# EAGLE design STM32F103C8BRD (EAGLE 7.6.0)
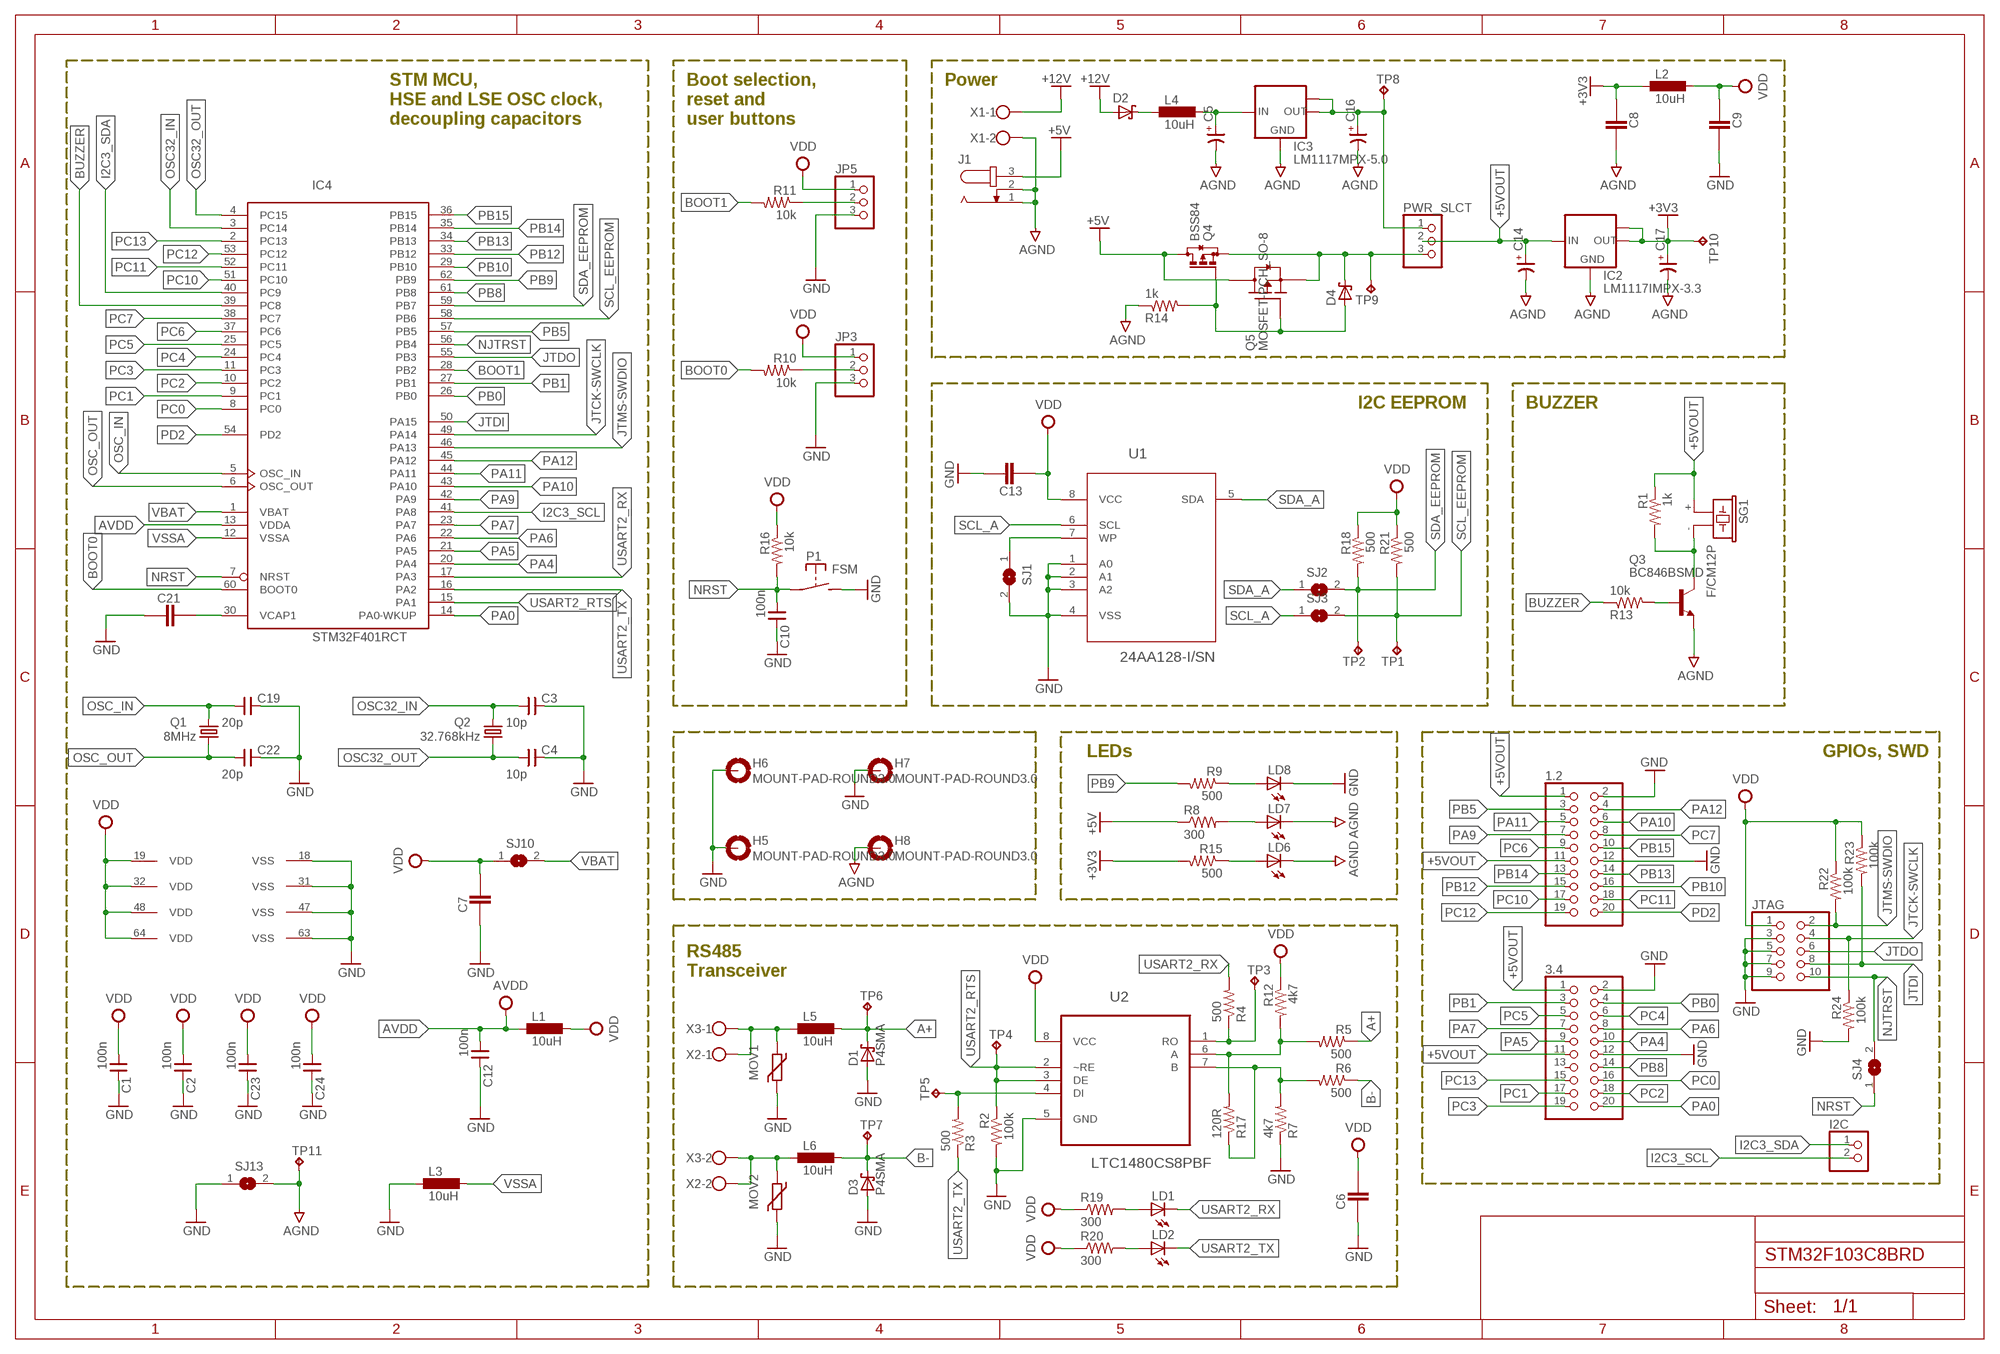
[diagram p0: schematic, sheet 1]

## Parts
1.2  PINHD-2X10  [2X10]
3.4  PINHD-2X10  [2X10]
C1  100n  CNP-0805  [0805]
C2  100n  CNP-0805  [0805]
C3  10p  CNP-0805  [0805]
C4  10p  CNP-0805  [0805]
C5  CP-3258-TE-B  [3528-TE-B]
C6  CAPACITOR_1206  [CAPC3215X168N]
C7  CAPACITOR_1206  [CAPC3215X168N]
C8  CAPACITOR_1206  [CAPC3215X168N]
C9  CAPACITOR_1206  [CAPC3215X168N]
C10  100n  CNP-0805  [0805]
C12  100n  CNP-0805  [0805]
C13  CAPACITOR_1206  [CAPC3215X168N]
C14  CP-3258-TE-B  [3528-TE-B]
C16  CP-3216-TE-A  [3216-TE-A]
C17  CP-3216-TE-A  [3216-TE-A]
C19  20p  CNP-0805  [0805]
C21  CAPACITOR_1206  [CAPC3215X168N]
C22  20p  CNP-0805  [0805]
C23  100n  CNP-0805  [0805]
C24  100n  CNP-0805  [0805]
D1  P4SMA  SCHOTTKY-DIODESMD  [SMB]
D2  SCHOTTKY_SMA  [DIOM5326X292N]
D3  P4SMA  SCHOTTKY-DIODESMD  [SMB]
D4  SCHOTTKY_SMA  [DIOM5326X292N]
H5  MOUNT-PAD-ROUND3.0  [3,0-PAD]
H6  MOUNT-PAD-ROUND3.0  [3,0-PAD]
H7  MOUNT-PAD-ROUND3.0  [3,0-PAD]
H8  MOUNT-PAD-ROUND3.0  [3,0-PAD]
I2C  PINHD-1X2  [1X02]
IC2  LM1117IMPX-3.3  [SOT223]
IC3  LM1117MPX-5.0  [SOT223]
IC4  STM32F401RCT  [LQFP64]
J1  JACK-PLUG1  [SPC4078]
JP3  PINHD-1X3  [1X03]
JP5  PINHD-1X3  [1X03]
JTAG  PINHD-2X5  [2X05]
L1  10uH  INDUCTOR_0603  [INDC1608X95N]
L2  10uH  INDUCTOR_0603  [INDC1608X95N]
L3  10uH  INDUCTOR_0603  [INDC1608X95N]
L4  10uH  INDUCTOR_0603  [INDC1608X95N]
L5  10uH  INDUCTOR_0603  [INDC1608X95N]
L6  10uH  INDUCTOR_0603  [INDC1608X95N]
LD1  LEDCHIPLED_0805  [CHIPLED_0805]
LD2  LEDCHIPLED_0805  [CHIPLED_0805]
LD6  LEDCHIPLED_0805  [CHIPLED_0805]
LD7  LEDCHIPLED_0805  [CHIPLED_0805]
LD8  LEDCHIPLED_0805  [CHIPLED_0805]
MOV1  VARISTOR_0805  [VARC2012X70N]
MOV2  VARISTOR_0805  [VARC2012X70N]
P1  FSM  [FSM]
PWR_SLCT  PINHD-1X3  [1X03]
Q1  8MHz  CRYTALHC49S  [HC49/S]
Q2  32.768kHz  CRYTALTC26H  [TC26H]
Q3  BC846BSMD  [SOT23]
Q4  BSS84  [SOT23]
Q5  MOSFET-PCH_SO-8  [SOIC127P600X175-8AN]
R1  1k  R-US_M0805  [M0805]
R2  100k  R-US_M0805  [M0805]
R3  500  R-US_M0805  [M0805]
R4  500  R-US_M0805  [M0805]
R5  500  R-US_M0805  [M0805]
R6  500  R-US_M0805  [M0805]
R7  4k7  R-US_M0805  [M0805]
R8  300  R-US_M0805  [M0805]
R9  500  R-US_M0805  [M0805]
R10  10k  R-US_M0805  [M0805]
R11  10k  R-US_M0805  [M0805]
R12  4k7  R-US_M0805  [M0805]
R13  10k  R-US_M0805  [M0805]
R14  1k  R-US_M0805  [M0805]
R15  500  R-US_M0805  [M0805]
R16  10k  R-US_M0805  [M0805]
R17  120R  R-US_M0805  [M0805]
R18  500  R-US_M0805  [M0805]
R19  300  R-US_M0805  [M0805]
R20  300  R-US_M0805  [M0805]
R21  500  R-US_M0805  [M0805]
R22  100k  R-US_M0805  [M0805]
R23  100k  R-US_M0805  [M0805]
R24  100k  R-US_M0805  [M0805]
SG1  F/CM12P  [F/CM12P]
SJ1  SJ  [SJ]
SJ2  SJ  [SJ]
SJ3  SJ  [SJ]
SJ4  SJ  [SJ]
SJ10  SJ  [SJ]
SJ13  SJ  [SJ]
TP1  TPTP10R  [TP10R]
TP2  TPTP10R  [TP10R]
TP3  TPTP10R  [TP10R]
TP4  TPTP10R  [TP10R]
TP5  TPTP10R  [TP10R]
TP6  TPTP10R  [TP10R]
TP7  TPTP10R  [TP10R]
TP8  TPTP10R  [TP10R]
TP9  TPTP10R  [TP10R]
TP10  TPTP10R  [TP10R]
TP11  TPTP10R  [TP10R]
U1  24AA128-I/SN  [SOIC127P600X175-8N]
U2  LTC1480CS8PBF  [SOIC127P600X175-8N]
X1  W237-102  [W237-102]
X2  W237-102  [W237-102]
X3  W237-102  [W237-102]

## Nets
+3V3: C8.1 C17.+ IC2.2(OUT) IC2.TAB(OUT1) L2.1 R15.2 TP10.TP
+5V: J1.3 Q4.3(D) Q5.5(D) R8.1
+5VOUT: 1.2.1 1.2.11 3.4.1 3.4.11 C14.+ IC2.3(IN) PWR_SLCT.2 R1.1 SG1.+
+12V: D2.A X1.1
A+: D1.C L5.2 R5.1 TP6.TP
AGND: C5.- C8.2 C14.- C16.- C17.- H8.B3,0(MOUNT) IC2.1(GND) IC3.1(GND) J1.1 J1.2 LD6.C LD7.C Q3.2(E) R14.1 SJ13.2 TP11.TP X1.2
AVDD: C12.1 IC4.13(VDDA) L1.1
B-: D3.C L6.2 R6.1 TP7.TP
BOOT0: IC4.60(BOOT0) R10.2
BOOT1: IC4.28(PB2) R11.2
BUZZER: IC4.39(PC8) R13.1
GND: 1.2.2 1.2.12 3.4.2 3.4.12 C1.2 C2.2 C3.2 C4.2 C6.1 C7.1 C9.2 C10.2 C12.2 C13.2 C19.2 C21.1 C22.2 C23.2 C24.2 D1.A D3.A H5.B3,0(MOUNT) H6.B3,0(MOUNT) H7.B3,0(MOUNT) IC4.18(VSS) IC4.31(VSS) IC4.47(VSS) IC4.63(VSS) JP3.3 JP5.3 JTAG.3 JTAG.5 JTAG.7 JTAG.9 L3.1 LD8.C MOV1.1 MOV2.1 P1.P$2(S) R2.2 R7.1 R24.2 SJ1.2 SJ13.1 U1.1(A0) U1.2(A1) U1.3(A2) U1.4(VSS) U2.5(GND)
I2C3_SCL: I2C.2 IC4.41(PA8)
I2C3_SDA: I2C.1 IC4.40(PC9)
JTCK-SWCLK: IC4.49(PA14) JTAG.4 R24.1
JTDI: IC4.50(PA15) JTAG.8 R23.2
JTDO: IC4.55(PB3) JTAG.6
JTMS-SWDIO: IC4.46(PA13) JTAG.2 R22.2
N$1: SJ1.1 U1.7(WP)
N$2: C21.2 IC4.30(VCAP1)
N$3: D2.K L4.1
N$4: R6.2 R7.2 R17.1 U2.7(B)
N$5: JP3.2 R10.1
N$6: LD7.A R8.2
N$8: R3.2 TP5.TP U2.4(DI)
N$9: R5.2 R12.2 R17.2 U2.6(A)
N$10: C5.+ IC3.3(IN) L4.2
N$12: L5.1 MOV1.2 X2.1 X3.1
N$13: L6.1 MOV2.2 X2.2 X3.2
N$14: R4.1 TP3.TP U2.1(RO)
N$15: LD8.A R9.1
N$17: Q3.3(C) R1.2 SG1.-
N$18: Q3.1(B) R13.2
N$19: LD6.A R15.1
N$20: LD1.A R19.2
N$21: LD2.A R20.2
N$22: D4.A Q4.1(G) Q5.4(G) R14.2
N$25: D4.K PWR_SLCT.3 Q4.2(S) Q5.1(S) TP9.TP
NJTRST: IC4.56(PB4) JTAG.10 SJ4.2
NRST: C10.1 IC4.7(NRST) P1.P$1(P) R16.2 SJ4.1
OSC32_IN: C3.1 IC4.3(PC14) Q2.2
OSC32_OUT: C4.1 IC4.4(PC15) Q2.1
OSC_IN: C19.1 IC4.5(OSC_IN) Q1.2
OSC_OUT: C22.1 IC4.6(OSC_OUT) Q1.1
PA0: 3.4.20 IC4.14(PA0-WKUP)
PA4: 3.4.10 IC4.20(PA4)
PA5: 3.4.9 IC4.21(PA5)
PA6: 3.4.8 IC4.22(PA6)
PA7: 3.4.7 IC4.23(PA7)
PA9: 1.2.7 IC4.42(PA9)
PA10: 1.2.6 IC4.43(PA10)
PA11: 1.2.5 IC4.44(PA11)
PA12: 1.2.4 IC4.45(PA12)
PB0: 3.4.4 IC4.26(PB0)
PB1: 3.4.3 IC4.27(PB1)
PB2: JP5.2 R11.1
PB5: 1.2.3 IC4.57(PB5)
PB8: 3.4.14 IC4.61(PB8)
PB9: IC4.62(PB9) R9.2
PB10: 1.2.16 IC4.29(PB10)
PB12: 1.2.15 IC4.33(PB12)
PB13: 1.2.14 IC4.34(PB13)
PB14: 1.2.13 IC4.35(PB14)
PB15: 1.2.10 IC4.36(PB15)
PC0: 3.4.16 IC4.8(PC0)
PC1: 3.4.17 IC4.9(PC1)
PC2: 3.4.18 IC4.10(PC2)
PC3: 3.4.19 IC4.11(PC3)
PC4: 3.4.6 IC4.24(PC4)
PC5: 3.4.5 IC4.25(PC5)
PC6: 1.2.9 IC4.37(PC6)
PC7: 1.2.8 IC4.38(PC7)
PC10: 1.2.17 IC4.51(PC10)
PC11: 1.2.18 IC4.52(PC11)
PC12: 1.2.19 IC4.53(PC12)
PC13: 3.4.15 IC4.2(PC13)
PD2: 1.2.20 IC4.54(PD2)
SCL_A: SJ3.1 U1.6(SCL)
SCL_EEPROM: IC4.58(PB6) R21.2 SJ3.2 TP1.TP
SDA_A: SJ2.1 U1.5(SDA)
SDA_EEPROM: IC4.59(PB7) R18.2 SJ2.2 TP2.TP
USART2_RTS: IC4.15(PA1) R2.1 TP4.TP U2.2(~RE) U2.3(DE)
USART2_RX: IC4.17(PA3) LD1.C R4.2
USART2_TX: IC4.16(PA2) LD2.C R3.1
VBAT: IC4.1(VBAT) SJ10.2
VCC_OUT: C16.+ IC3.2(OUT) IC3.TAB(OUT1) PWR_SLCT.1 TP8.TP
VDD: C1.1 C2.1 C6.2 C7.2 C9.1 C13.1 C23.1 C24.1 IC4.19(VDD) IC4.32(VDD) IC4.48(VDD) IC4.64(VDD) JP3.1 JP5.1 JTAG.1 L1.2 L2.2 R12.1 R16.1 R18.1 R19.1 R20.1 R21.1 R22.1 R23.1 SJ10.1 U1.8(VCC) U2.8(VCC)
VSSA: IC4.12(VSSA) L3.2
Unconnected: 3.4.13

## Notes on the sheet
- Power
- STM MCU, 
  HSE and LSE OSC clock,
  decoupling capacitors
- Boot selection,
  reset and
  user buttons
- I2C EEPROM | BUZZER
- LEDs | GPIOs, SWD
- RS485
  Transceiver

## Library data of the parts
1.2 3.4 = pinhead:PINHD-2X10: PIN HEADER
C1-C4 C10 C12 C19 C22-C24 = cap-master:CNP-: NON-POLARIZED CAP
C5 C14 C16 C17 = cap-master:CP-: POLARIZED CAP
C6-C9 C13 C21 = ipc-7351-capacitor:CAPACITOR_
D1 D3 = diode:SCHOTTKY-DIODE: Schottky Diode
D2 D4 = ipc-7351-diode:SCHOTTKY_
H5-H8 = holes:MOUNT-PAD-ROUND: MOUNTING PAD, round
I2C = pinhead:PINHD-1X2: PIN HEADER
IC2 = lm1117:LM1117IMPX-*
IC3 = lm1117:LM1117MPX-*
IC4 = micro-stm:STM32F401R*T: ARM 32-bit Cortex™-M3 CPU 84 MHz maximum frequency 128 to 256 Kbytes of Flash memory 64 kbytes of SRAM 50 GPIOs 1.7 to 3.6 V application supply
J1 = con-jack:JACK-PLUG: DC POWER JACK Power Jack, DC, Right Angle, Through Hole, Rated 5A at 16VDC, PC Terminals Distributor: Farnell (www.Farnell.de) Drawing: 84N1161.pdf / 84N1162.pdf Manufacturer: SPC Technology (www.spctechnology.com) Type: SPC4077 / SPC 4078
JP3 JP5 PWR_SLCT = pinhead:PINHD-1X3: PIN HEADER
JTAG = pinhead:PINHD-2X5: PIN HEADER
L1-L6 = ipc-7351-inductor:INDUCTOR_
LD1 LD2 LD6-LD8 = led:LED: LED OSRAM: - CHIPLED LG R971, LG N971, LY N971, LG Q971, LY Q971, LO R971, LY R971 LH N974, LH R974 LS Q976, LO Q976, LY Q976 LO Q996 - Hyper CHIPLED LW Q18S LB Q993, LB Q99A, LB R99A - SideLED LS A670, LO A670, LY A670, LG A670, LP A670 LB A673, LV A673, LT A673, LW A673 LH A674 LY A675 LS A676, LA A676, LO A676, LY A676, LW A676 LS A679, LY A679, LG A679 - Hyper Micro SIDELED® LS Y876, LA Y876, LO Y876, LY Y876 LT Y87S - SmartLED LW L88C, LW L88S LB L89C, LB L89S, LG L890 LS L89K, LO L89K, LY L89K LS L896, LA L896, LO L896, LY L896 - TOPLED LS T670, LO T670, LY T670, LG T670, LP T670 LSG T670, LSP T670, LSY T670, LOP T670, LYG T670 LG T671, LOG T671, LSG T671 LB T673, LV T673, LT T673, LW T673 LH T674 LS T676, LA T676, LO T676, LY T676, LB T676, LH T676, LSB T676, LW T676 LB T67C, LV T67C, LT T67C, LS T67K, LO T67K, LY T67K, LW E67C LS E67B, LA E67B, LO E67B, LY E67B, LB E67C, LV E67C, LT E67C LW T67C LS T679, LY T679, LG T679 LS T770, LO T770, LY T770, LG T770, LP T770 LB T773, LV T773, LT T773, LW T773 LH T774 LS E675, LA E675, LY E675, LS T675 LS T776, LA T776, LO T776, LY T776, LB T776 LHGB T686 LT T68C, LB T68C - Hyper Mini TOPLED® LB M676 - Mini TOPLED Santana® LG M470 LS M47K, LO M47K, LY M47K Source: http://www.osram.convergy.de/
MOV1 MOV2 = varistor:VARISTOR_: MLA Varistor Series. The MLA Series (also known as "ML" series) family of transient voltage surge suppression devices is based on the Littelfuse Multilayer fabrication technology.
P1 = switch-misc:FSM: TYCO SWITCH
Q1 Q2 = crystal:CRYTAL: CRYSTAL
Q3 = transistor-npn:BC846*: NPN Transistor
Q4 = transistor-small-signal:BSS84: P-CHANNEL MOS FET
Q5 = ipc-7351-transistor:MOSFET-PCH_
R1-R24 = resistor:R-US_: RESISTOR, American symbol
SG1 = buzzer:F/CM12P: BUZZER Source: Buerklin
SJ1-SJ4 SJ10 SJ13 = jumper:SJ: SMD solder JUMPER
TP1-TP11 = testpad:TP: Test pad
U1 = Microchip_By_element14_Batch_1:24AA128-I/SN: 128K I2C CMOS Serial EEPROM; DESCRIPTION: 128K I2C CMOS Serial EEPROM; MPN: 24AA128-I/SN; OC_FARNELL: -; OC_NEWARK: 92C6842; PACKAGE: SOIC-8; SUPPLIER: Microchip
U2 = LTC_By_element14_Batch_1:LTC1480CS8PBF: 3.3V Ultralow Power RS485 Transceiver; MPN: LTC1480CS8#PBF; OC_FARNELL: 1663633; OC_NEWARK: 56M1547; PACKAGE: SOIC-8; SUPPLIER: Linear Technology
X1-X3 = con-wago-500:W237-102: WAGO SCREW CLAMP

## Board
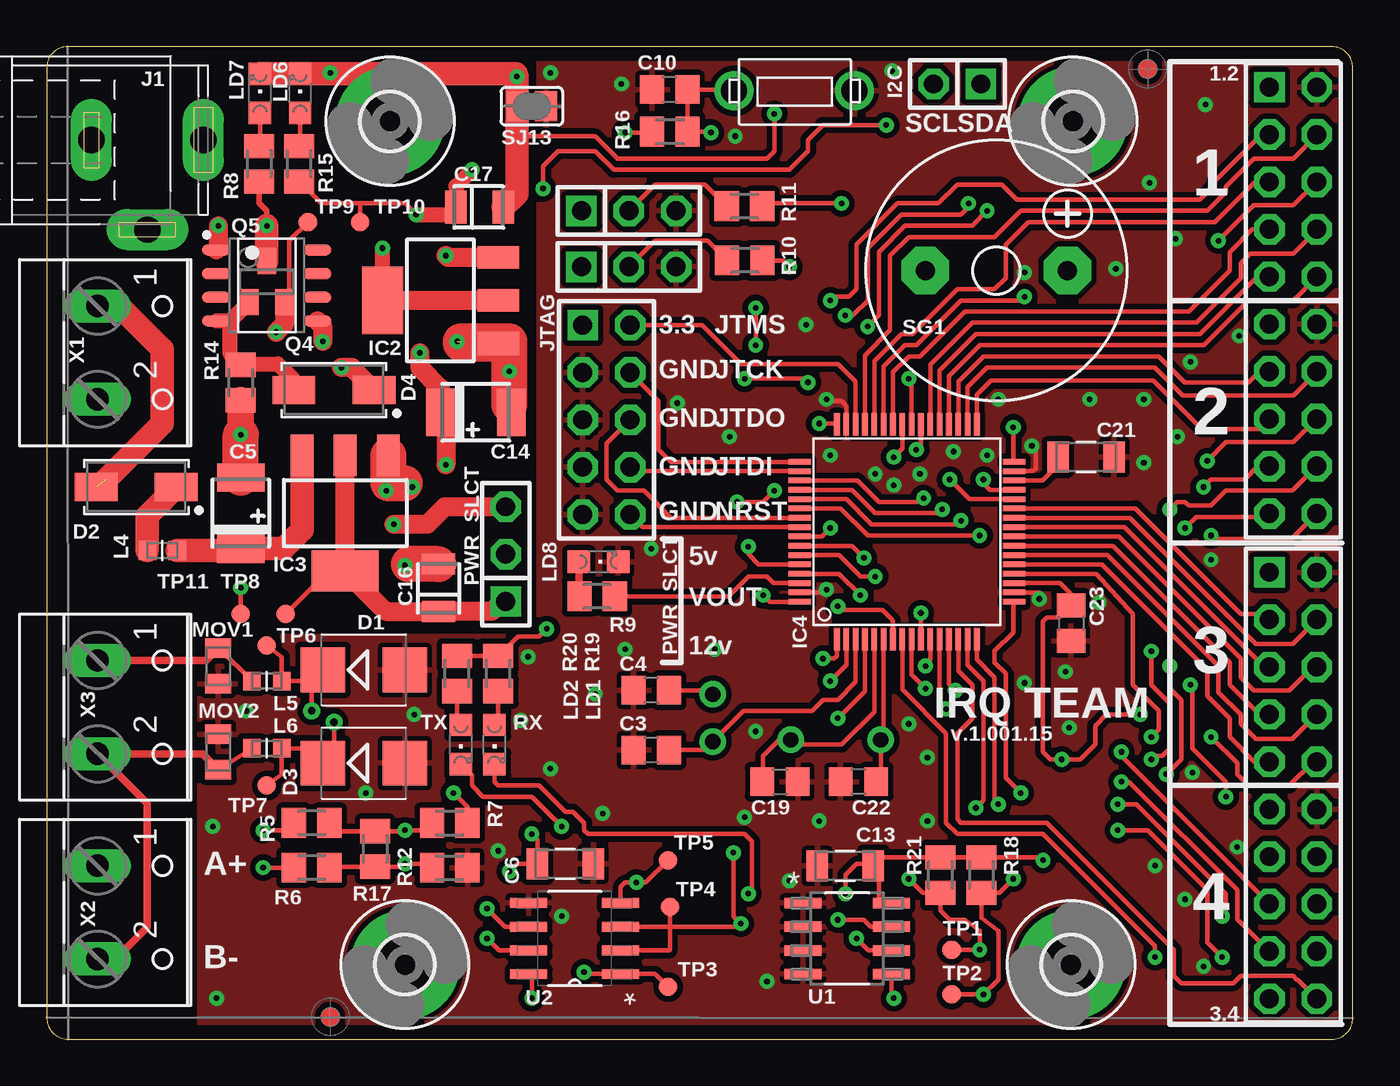
[diagram p1: board, top side]
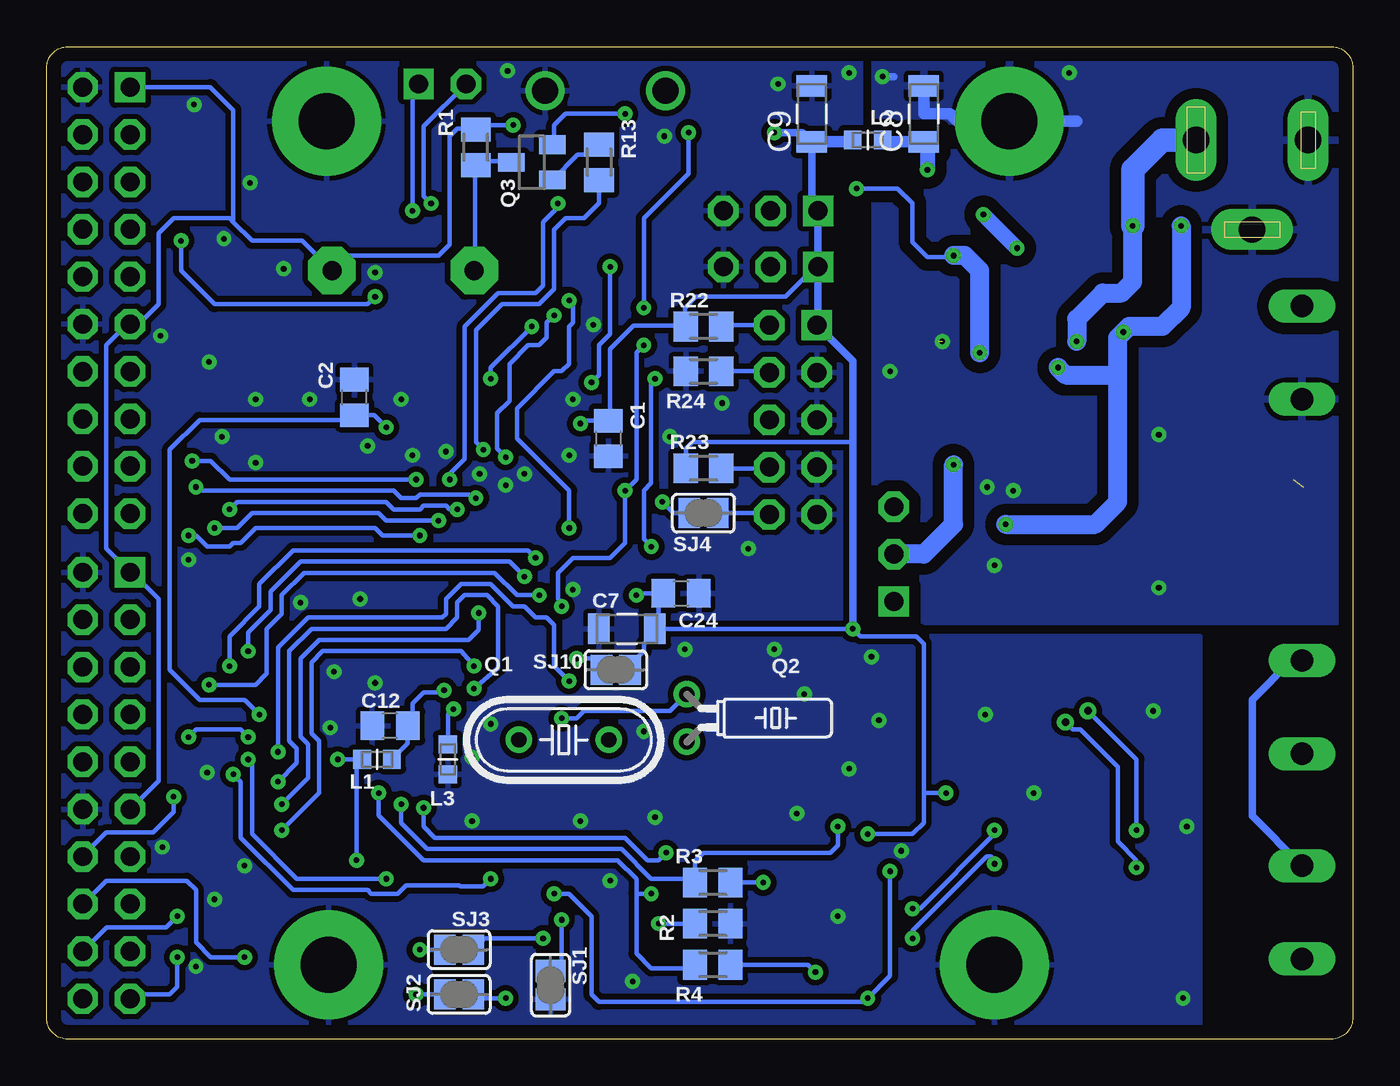
[diagram p2: board, bottom side, seen from below]

Size 70 x 53.2 mm. Coordinates in mm from the lower left corner, seen from the top.
Outline: 70,1.13 70,52.07 arc90 68.87,53.2 1.13,53.2 arc90 0,52.07 0,1.17 arc90 1.17,0 68.87,0 arc90 70,1.13
Copper layers (1*16): Top 0.018mm / dielectric 0.5mm / Bottom 0.018mm
Design rules "rezonit *": minimum track width 0.25mm, minimum drill 0.4mm, track to track 0.3mm, track to pad 0.3mm, pad to pad 0.3mm, via to via 0.3mm, smd to smd 0mil, copper to edge 30mil, drill to drill 8mil, minimum pad ring 12mil, minimum via ring 0.25mm, stop-mask expansion 0.07mm, vias tented up to drill 0.4mm, thermal gap 10mil

### Footprints (pad centres in the part's own frame; a part is rotated, then mirrored left to right if it is on the bottom)
2X10 = drill 1.016 square: 1 -11.43,-1.27 | drill 1.016 octagon: 2 -11.43,1.27; 3 -8.89,-1.27; 4 -8.89,1.27; 5 -6.35,-1.27; 6 -6.35,1.27; 7 -3.81,-1.27; 8 -3.81,1.27; 9 -1.27,-1.27; 10 -1.27,1.27; 11 1.27,-1.27; 12 1.27,1.27; 13 3.81,-1.27; 14 3.81,1.27; 15 6.35,-1.27; 16 6.35,1.27; 17 8.89,-1.27; 18 8.89,1.27; 19 11.43,-1.27; 20 11.43,1.27
0805 = smd 1.27 x 1.524: 1 -0.953,0; 2 0.953,0
3528-TE-B = smd 1.524 x 2.54: + 1.905,0; - -1.905,0
CAPC3215X168N = smd 1.15 x 1.65: 1 -1.5,0; 2 1.5,0
3216-TE-A = smd 1.143 x 1.778: + 1.27,0; - -1.27,0
SMB = smd 2.4 x 2.4: A 2.2,0; C -2.2,0
DIOM5326X292N = smd 2.3 x 1.5: A 2.15,0; K -2.15,0
3,0-PAD = drill 3 pad 5.842: B3,0 0,0
1X02 = drill 1.016 square: 1 -1.27,0 | drill 1.016 octagon: 2 1.27,0
SOT223 = smd 1.219 x 2.235: 1 -2.311,-3.099; 2 0,-3.099; 3 2.311,-3.099 | smd 3.6 x 2.2: TAB 0,3.099
LQFP64 = smd 0.3 x 1.2: 1 -3.75,-5.75; 2 -3.25,-5.75; 3 -2.75,-5.75; 4 -2.25,-5.75; 5 -1.75,-5.75; 6 -1.25,-5.75; 7 -0.75,-5.75; 8 -0.25,-5.75; 9 0.25,-5.75; 10 0.75,-5.75; 11 1.25,-5.75; 12 1.75,-5.75; 13 2.25,-5.75; 14 2.75,-5.75; 15 3.25,-5.75; 16 3.75,-5.75; 33 3.75,5.75; 34 3.25,5.75; 35 2.75,5.75; 36 2.25,5.75; 37 1.75,5.75; 38 1.25,5.75; 39 0.75,5.75; 40 0.25,5.75; 41 -0.25,5.75; 42 -0.75,5.75; 43 -1.25,5.75; 44 -1.75,5.75; 45 -2.25,5.75; 46 -2.75,5.75; 47 -3.25,5.75; 48 -3.75,5.75 | smd 1.2 x 0.3: 17 5.75,-3.75; 18 5.75,-3.25; 19 5.75,-2.75; 20 5.75,-2.25; 21 5.75,-1.75; 22 5.75,-1.25; 23 5.75,-0.75; 24 5.75,-0.25; 25 5.75,0.25; 26 5.75,0.75; 27 5.75,1.25; 28 5.75,1.75; 29 5.75,2.25; 30 5.75,2.75; 31 5.75,3.25; 32 5.75,3.75; 49 -5.75,3.75; 50 -5.75,3.25; 51 -5.75,2.75; 52 -5.75,2.25; 53 -5.75,1.75; 54 -5.75,1.25; 55 -5.75,0.75; 56 -5.75,0.25; 57 -5.75,-0.25; 58 -5.75,-0.75; 59 -5.75,-1.25; 60 -5.75,-1.75; 61 -5.75,-2.25; 62 -5.75,-2.75; 63 -5.75,-3.25; 64 -5.75,-3.75
SPC4078 = drill 1.4 pad 2.184 long: 1 -3,0; 2 0,-4.8; 3 3,0
1X03 = drill 1.016 square: 1 -2.54,0 | drill 1.016 octagon: 2 0,0; 3 2.54,0
2X05 = drill 1.016 square: 1 -5.08,-1.27 | drill 1.016 octagon: 2 -5.08,1.27; 3 -2.54,-1.27; 4 -2.54,1.27; 5 0,-1.27; 6 0,1.27; 7 2.54,-1.27; 8 2.54,1.27; 9 5.08,-1.27; 10 5.08,1.27
INDC1608X95N = smd 0.95 x 1: 1 -0.8,0; 2 0.8,0
CHIPLED_0805 = smd 1.2 x 1.2: A 0,-1.05; C 0,1.05
VARC2012X70N = smd 1.05 x 1.4: 1 -0.95,0; 2 0.95,0
FSM = drill 1.397: P$1 0,3.25; P$2 0,-3.2
HC49/S = drill 0.813: 1 -2.413,0; 2 2.413,0
TC26H = drill 0.813: 1 -1.27,0; 2 1.27,0
SOT23 = smd 1 x 1.4: 1 -0.95,-1.1; 2 0.95,-1.1; 3 0,1.1
SOIC127P600X175-8AN = smd 1.55 x 0.6: 1 -2.7,1.905; 2 -2.7,0.635; 3 -2.7,-0.635; 4 -2.7,-1.905; 5 2.7,-1.905; 6 2.7,-0.635; 7 2.7,0.635; 8 2.7,1.905
M0805 = smd 1.3 x 1.6: 1 -0.95,0; 2 0.95,0
F/CM12P = drill 1.016 pad 2.54 octagon: + 3.81,0; - -3.81,0
SJ = smd 1.168 x 1.6: 1 -0.762,0; 2 0.762,0
TP10R = smd 1 x 1: TP 0,0
SOIC127P600X175-8N = smd 1.981 x 0.559: 1 -2.362,1.905; 2 -2.362,0.635; 3 -2.362,-0.635; 4 -2.362,-1.905; 5 2.362,-1.905; 6 2.362,-0.635; 7 2.362,0.635; 8 2.362,1.905
SOIC127P600X175-8N' = smd 1.981 x 0.533: 1 -2.464,1.905; 2 -2.464,0.635; 3 -2.464,-0.635; 4 -2.464,-1.905; 5 2.464,-1.905; 6 2.464,-0.635; 7 2.464,0.635; 8 2.464,1.905
W237-102 = drill 1.194 long: 1 -2.5,-1.27; 2 2.5,-1.27

### Placement (x,y rotation side)
1.2  66.8,39.6 270 top
3.4  66.8,13.6 270 top
C1  39.9,32.2 270 bottom
C2  53.5,34.4 90 bottom
C3  32.4,15.5 180 top
C4  32.4,18.7 180 top
C5  10.4,28.2 270 top
C6  27.8,9.4 180 top
C7  38.9,22 0 bottom
C8  23,49.6 90 bottom
C9  29,49.6 90 bottom
C10  33.39,50.89 180 top
C12  51.6,16.8 180 bottom
C13  42.8,9.3 180 top
C14  23,33.6 180 top
C16  21,24.2 270 top
C17  23.2,44.6 180 top
C19  39.3,13.8 0 top
C21  55.7,31.2 180 top
C22  43.5,13.8 180 top
C23  54.9,22.3 270 top
C24  36,23.9 0 bottom
D1  17,19.8 0 top
D2  4.8,29.6 180 top
D3  17,14.8 0 top
D4  15.4,34.8 180 top
H5  19.2,4 0 top
H6  54.9,4 0 top
H7  55,49.2 0 top
H8  18.4,49.2 0 top
I2C  48.8,51.2 180 top
IC2  21.1,39.6 90 top
IC3  16,28.2 180 top
IC4  46.1,27.2 0 top
J1  5.4,48.2 0 top
JP3  31.2,41.4 0 top
JP5  31.2,44.4 0 top
JTAG  30,33.2 270 top
L1  52.3,15 180 bottom
L2  26,48.2 180 bottom
L3  48.5,15 90 bottom
L4  6.2,26.2 0 top
L5  11.8,19.2 0 top
L6  11.8,15.6 0 top
LD1  24,15.8 180 top
LD2  22.2,15.8 180 top
LD6  13.58,50.7 0 top
LD7  11.44,50.7 0 top
LD8  29.57,25.59 270 top
MOV1  9.2,20 90 top
MOV2  9.2,15.4 270 top
P1  40.09,50.83 90 top
PWR_SLCT  24.6,26 90 top
Q1  42.29,16.05 0 bottom
Q2  35.69,17.22 270 bottom
Q3  44,47 90 bottom
Q4  11.8,40.6 0 top
Q5  11.8,40.4 0 top
R1  47,47.8 270 bottom
R2  34.3,6.2 0 bottom
R3  34.3,8.4 0 bottom
R4  34.3,4 180 bottom
R5  14.2,11.6 0 top
R6  14.2,9.2 0 top
R7  21.6,9.2 180 top
R8  11.39,46.92 90 top
R9  29.5,23.74 0 top
R10  37.41,41.74 0 top
R11  37.4,44.64 0 top
R12  21.6,11.6 180 top
R13  40.4,47 90 bottom
R14  10.4,35.2 90 top
R15  13.54,46.92 270 top
R16  33.39,48.63 0 top
R17  17.6,10.2 90 top
R18  50.1,8.8 270 top
R19  24.2,19.6 270 top
R20  22,19.6 270 top
R21  47.9,8.8 270 top
R22  34.8,38.2 0 bottom
R23  34.8,30.6 0 bottom
R24  34.8,35.8 180 bottom
SG1  50.9,41.2 0 top
SJ1  43,2.9 270 bottom
SJ2  47.9,2.4 180 bottom
SJ3  47.9,4.8 180 bottom
SJ4  34.8,28.2 0 bottom
SJ10  39.5,19.8 180 bottom
SJ13  26,50 180 top
TP1  48.5,4.8 0 top
TP2  48.5,2.4 0 top
TP3  33.3,2.8 0 top
TP4  33.4,7.1 0 top
TP5  33.3,9.6 0 top
TP6  11.8,21.1 0 top
TP7  11.8,13.6 0 top
TP8  12.8,22.8 0 top
TP9  14,43.8 0 top
TP10  16.8,43.8 0 top
TP11  10.4,22.8 0 top
U1  42.9,5.4 0 top
U2  LTC1480CS8PBF  [SOIC127P600X175-8N']  28.3,5.4 180 top
U$3  [FIDUCIAL_G10]  15.2,1.2 0 top
U$4  [FIDUCIAL_G10]  59,52 0 top
X1  4,36.8 270 top
X2  4,6.8 270 top
X3  4,17.8 270 top

### Tracks (layer width: path | path; a pad name or v marks a point on that pad's centre or on a via)
+3V3  (via drill 0.3)
  Top 0.254: R15.2 14.7,44.8 16.8,44.8 | 16.8,44.8 19.2,44.8 v19.8,44.2 | TP10.TP 16.8,44.8
  Top 0.61: IC2.TAB
  Top 0.813: v22.8,46.6 21.93,45.73 C17.+ 21.93,44.53 21.6,44.2 v19.8,44.2 | IC2.TAB v18,42.4
  Top 1.016: IC2.2 IC2.TAB
  Bottom 0.61: L2.1 25.2,48.1 C8.1 22.8,48.1
  Bottom 0.813: 22.8,48.1 v22.8,46.6 | v18,42.4 v19.8,44.2
+5V  (via drill 0.3)
  Top 0.305: R8.1 11.39,44.81 11.8,44.4 v11.8,43.6
  Top 1.016: Q5.5 14.8,38.2 v14.8,37.4
  Top 1.27: v11.8,43.6 Q4.3
  Bottom 1.016: v11.8,43.6 11.8,40.6 12.4,40 13.4,40 14.8,38.6 v14.8,37.4
  Bottom 1.27: J1.3 10.2,48.2 11.8,46.6 v11.8,43.6
+5VOUT  (via drill 0.3)
  Top 0.152: C14.+ 21.11,33.6 21.4,33.9
  Top 0.254: v45,49 41.6,49 40.8,48.2 40.8,47.6 39.8,46.6 30.4,46.6 29.4,47.6 27.4,47.6 26.6,46.8 v26.6,45.6
  Top 1.016: C14.+ 21.09,34.91 20,36 v20,36.8 | v21.4,42 21.49,41.91 IC2.3 | 21.4,33.9 v21.4,30.8
  Bottom 0.254: v26.6,45.6 24.4,45.6 23.6,44.8 23.6,42.71 22.8,41.91 21.49,41.91 v21.4,42 | 1.2.1 61.23,51.03 60,49.8 60,43.8 | 60,43.8 59,42.8 56.31,42.8 SG1.+ 53.91,42 49,42 48.4,42.6 48.4,48.4 48,48.8 47.05,48.8 R1.1 46.75,49 v45,49 | 60,43.8 60.2,44 63.2,44 64,43.2 64,39.4 65.07,38.33 1.2.11 65.67,38.33 66.8,37.2 66.8,26.3 3.4.1 65.43,25.03 64,23.6 64,13.86 3.4.11
  Bottom 1.016: v20,36.8 20,41.2 20.8,42 v21.4,42 | v21.4,30.8 21.4,27.6 23,26 PWR_SLCT.2
+12V  (1 unrouted)
  Top 1.27: X1.1 3.9,39.3 6.2,37 6.2,33 3.2,30
A+  (via drill 0.3, 0.4)
  Top 0.254: 14.2,19.2 L5.2 12.6,20.5 TP6.TP | R5.1 12.85,11.2 v11.6,11.2 | v14.2,17.6 14.2,19.2 | 14.2,19.2 D1.C
  Bottom 0.254: v11.6,11.2 11.6,15 v14.2,17.6
AGND  (via drill 0.3)  (1 unrouted)
  Top 0.152: C14.- 24.91,33.9 24.8,34
  Top 0.254: v39,49.6 39,47.6 38.6,47.2 30.6,47.2 29.4,48.4 25.2,48.4 | TP11.TP v10.4,24.2 | 25.15,51.75 25.2,51.69 v25.2,51.6
  Top 0.406: SJ13.2 25.2,50.04 v25.2,51.6
  Top 0.61: v18.2,29.4 18.2,29.8 18.31,29.8 | v19.2,25.4 19.4,25.4 19.4,25.47
  Top 1.27: C17.- 25.2,45.33 25.2,48.4 v25.2,51.6 | 25.15,51.75 LD6.C LD7.C
  Top 1.422: R14.1 v10.4,32.4
  Top 1.93: C5.- v10.4,32.4 | 24.8,34 24.8,37.4 22.2,37.4 22.2,37.29 IC2.1 | IC3.1 18.31,29.8 19.2,29.8 | C16.- 19.4,25.47
  Bottom 0.254: Q3.2 42.8,48.05 42.8,49 42.2,49.6 v39,49.6 | v10.4,24.2 10.6,24.2
  Bottom 0.406: v25.2,51.6 24.6,51.6
  Bottom 0.61: C8.2 23,49.6 21.6,49.6 21.2,49.2 H8.B3,0 14.8,49.2
  other vias: 24.8,35.8 22,37.4 19.6,29.6 15.2,51.8
  pour Bottom (isolate 0.61): -0.8,54 25.6,54 25.6,22.4 -0.8,22.4
AVDD  (via drill 0.3)
  Top 0.254: IC4.13 48.35,19.05 v48.7,18.7
  Bottom 0.254: v48.7,18.7 48.8,18.6 49.8,18.6 50.4,18 50.4,16.85 C12.1 50.65,15.85 L1.1
B-  (via drill 0.3, 0.4)
  Top 0.254: 14.2,15.6 L6.2 12.6,14.2 TP7.TP | 14.2,15.6 14.4,15.4 14.4,15.2 D3.C | R6.1 v11.6,9.2 | v15.4,17 15.4,15.6 14.2,15.6
  Bottom 0.254: v11.6,9.2 11.6,9.6 12.6,10.6 12.6,14.6 14.6,16.6 15,16.6 v15.4,17
BOOT0  (via drill 0.3)
  Top 0.254: IC4.60 38.15,25.45 37.6,26 v37.6,26.4 | v37.4,35.4 40.6,35.4 v40.8,35.2 | R10.2 39.46,41.74 v39.8,41.4
  Bottom 0.254: v37.6,26.4 38,26.8 38,29.4 37.6,29.8 37.6,35.2 v37.4,35.4 | v39.8,41.4 39.8,37.8 40.4,37.2 40.4,35.6 v40.8,35.2
BOOT1  (via drill 0.3)
  Top 0.254: IC4.28 49.45,28.95 v48.4,30 | v42.6,44.8 38.5,44.8 R11.2
  Bottom 0.254: v48.4,30 48.4,30.3 47.6,31.1 47.6,38.2 45.8,40 43.8,40 43.4,40.4 43.4,43.8 42.6,44.6 v42.6,44.8
BUZZER  (via drill 0.3)
  Top 0.254: IC4.39 46.85,31.85 v46.6,31.6
  Bottom 0.254: v46.6,31.6 47,32 47,38 45.6,39.4 43.6,39.4 42.8,40.2 42.8,43.4 42.2,44 41.2,44 40.4,44.8 R13.1
GND  (via drill 0.3)
  Top 0.254: IC4.18 53.2,23.95 v53.2,23.6 | IC4.63 41.65,23.95 v41.8,24.1 | IC4.31 52.85,30.45 53,30.6 53,31.8 | IC4.47 42.85,33.95 42.6,34.2 41.9,34.2 v41.8,34.3
  other vias: 10.7,17.6 9.1,2.2 8.9,11.4 19.7,17.4 27,51.8 30.8,51.2 27.6,6.6 56.4,23.4 52.8,31.8 36.9,48.4 38.6,3.1 58.8,30.9 55.9,34.3 48.6,31.5 50.4,31.3 51,34.3 57.3,41.3 40.7,38.3 59.1,45.9 52.4,41.1 42,31.3 45.4,29.7 58.8,34.3 62.4,25.7 52.4,19.1 54.8,16.7 59.4,9.3 61,7.5 47.2,11.7 62,3.9 39.8,8.5 63.9,37.7 61.3,36.3 60.5,42.9 45.3,51.9 32.4,26.3 62.1,50.1 44.4,30.3 46.8,30.3 60.6,32.3 46.2,16.9 47.2,15.1 41.4,11.7 37.4,11.9 29.4,18.5 29.8,12.1 25.4,17.1 25.8,20.5 31,20.9 35.8,20.9 38,16.5 27,14.5 24.2,10.1 61.4,14.3 63.8,10.3 17.1,13.2 54.6,19.7 36.6,32.3 33.8,34.1
  pour Bottom: 26.4,54 70.8,54 70.8,-0.8 8.2,-0.8 8.2,21.6 26.4,21.6
  pour Top: 26.4,54 70.8,54 70.8,-0.8 8.2,-0.8 8.2,21.6 26.4,21.6
I2C3_SCL  (via drill 0.3)
  Top 0.254: IC4.41 45.85,31.65 v45.4,31.2 | v42.8,38.8 43.2,38.8 44,39.6 44,42.4 45.8,44.2 49,44.2 49.4,44.6 v49.4,44.8
  Bottom 0.254: v45.4,31.2 45.85,31.65 45.85,33.55 45.2,34.2 45.2,36.2 44.2,37.2 43.6,37.2 43.2,37.6 43.2,38.4 v42.8,38.8 | v49.4,44.8 49.8,45.2 49.8,48.93 I2C.2
I2C3_SDA  (via drill 0.3)
  Top 0.254: IC4.40 46.35,35.25 v46.2,35.4 | v44,38.2 44.6,38.8 44.6,42.2 46,43.6 49.6,43.6 v50.4,44.4
  Bottom 0.254: v46.2,35.4 46.2,36 v44,38.2 | v50.4,44.4 50.4,50.87 I2C.1
JTCK-SWCLK
  Top 0.254: IC4.49 33.45,30.95 32.8,31.6 32.8,34.21 JTAG.4
  Bottom 0.254: R24.1 31.33,35.8 JTAG.4
JTDI
  Top 0.254: IC4.50 31.48,30.45 JTAG.8
  Bottom 0.254: R23.2 31.33,30.6 JTAG.8
JTDO
  Top 0.254: IC4.55 33.45,27.95 32,29.4 30.6,29.4 30,30 30,31.93 JTAG.6
JTMS-SWDIO
  Top 0.254: IC4.46 43.35,35.25 42.4,36.2 37.2,36.2 35.12,38.28 JTAG.2
  Bottom 0.254: R22.2 33.77,38.28 JTAG.2
N$1  (via drill 0.3)
  Top 0.254: U1.7 44.16,6.04 43.8,6.4 v42.4,6.4
  Bottom 0.254: v42.4,6.4 42.4,4 42.66,4 SJ1.1
N$2
  Top 0.254: IC4.30 53.35,29.95 54,30.6 54,31 C21.2
N$3
  Top 1.27: L4.1 5.4,28.05 D2.K
N$4  (via drill 0.3)
  Top 0.254: U2.7 24.23,4.76 v23.6,5.4 | R7.2 20.45,9.4 v19.2,9.4 19.05,9.25 R17.1 15.2,9.25 R6.2
  Bottom 0.254: v23.6,5.4 23.6,5.8 19.6,9.8 19.4,9.8 19.2,9.6 v19.2,9.4
N$5
  Top 0.254: JP3.2 32.6,42.8 35.41,42.8 R10.1
N$6
  Top 0.254: R8.2 11.44,47.91 LD7.A
N$8  (via drill 0.3)
  Top 0.254: U2.4 30.76,8.16 31,8.4 v31.6,8.4 32.1,8.4 TP5.TP
  Bottom 0.254: R3.2 v31.6,8.4
N$9  (via drill 0.3)
  Top 0.254: 25.8,6 U2.6 24.57,6.04 v23.6,7 | R12.2 20.25,11.2 v19.2,11.2 19.15,11.15 R17.2 15.6,11.15 R5.2
  Bottom 0.254: v23.6,7 23.2,7 19.2,11 v19.2,11.2
N$10
  Top 1.27: L4.2 10.3,26.2 C5.+ 12.7,26.3 13.69,27.29 IC3.3
N$12
  Top 0.254: MOV1.2 9.25,20.95 L5.1
  Top 0.406: X3.1 8.55,20.3 MOV1.2
  Bottom 0.406: X3.1 3.3,20.3 5.4,18.2 5.4,11.97 X2.1
N$13
  Top 0.254: L6.1 MOV2.2
  Top 0.406: MOV2.2 8.35,15.3 X3.2 5.4,12.63 5.4,6 3.7,4.3 X2.2
N$14  (via drill 0.3)
  Top 0.254: v28.8,3.6 28.91,3.5 U2.1 32.6,3.5 TP3.TP
  Bottom 0.254: R4.1 29.2,4 v28.8,3.6
N$15
  Top 0.406: LD8.A 28.52,23.77 R9.1
N$17
  Bottom 0.254: Q3.3 45.15,47.05 46.8,47.05 R1.2 47.05,47 47.05,41.24 SG1.-
N$18
  Bottom 0.254: Q3.1 41.55,47.4 41,47.4 40.45,47.95 R13.2
N$19
  Top 0.254: R15.1 13.58,47.91 LD6.A
N$20
  Top 0.254: R19.2 24.2,17.05 LD1.A
N$21
  Top 0.254: R20.2 22,17.05 LD2.A
N$22
  Top 0.813: Q4.1 9.85,38.49 | 9.85,38.49 Q5.4 | 9.85,38.49 9.85,36.7 R14.2 10.45,36.2 12.4,36.2 13.25,35.35 D4.A
N$25  (via drill 0.3)
  Top 0.254: Q4.2 13,39.75 13,42.8 TP9.TP
  Top 1.016: D4.K 16.35,36 v15.8,36 | v18.6,27.6 20.4,27.6 21.34,28.54 PWR_SLCT.3 | v9.2,43.6 9.2,42.41 Q5.1 | Q4.2 12.75,38.35 v12.3,37.9
  Bottom 1.016: v18.6,27.6 13.8,27.6 12.6,28.8 12.6,35.6 | 12.6,35.6 12.6,37.6 v12.3,37.9 12,38.2 10.2,38.2 9.2,39.2 v9.2,43.6 | v15.8,36 15.4,35.6 12.6,35.6
NJTRST
  Top 0.254: IC4.56 31.94,27.45 JTAG.10
  Bottom 0.254: SJ4.2 31.35,28.2 JTAG.10
NRST  (via drill 0.3)
  Top 0.254: P1.P$1 36.78,50.89 C10.1 R16.2 35.57,48.63 v35.6,48.6 | IC4.7 45.35,22.45 44.8,23 42.6,23 v42.4,23.2 | v38,37.2 v38,39.2 | v39,29.4 38.4,28.8 v37,28.8
  Bottom 0.254: v35.6,48.6 35.6,46.4 38,44 v38,39.2 | v42.4,23.2 42.4,23.4 42.6,23.6 42.6,25 41.8,25.8 39.8,25.8 39,26.6 v39,29.4 38.4,30 38.4,36.8 v38,37.2 | v37,28.8 36.4,28.2 SJ4.1
OSC32_IN
  Top 0.254: C3.1 35.24,15.5 Q2.2 37.34,17.6 41,17.6 41.6,18.2 42.4,18.2 43.35,19.15 IC4.3
OSC32_OUT  (via drill 0.3)
  Top 0.254: IC4.4 43.85,18.65 v42.4,17.2 | Q2.1 35.48,18.7 C4.1
  Bottom 0.254: 36.18,18 Q2.1 36.58,17.6 41.2,17.6 41.6,17.2 v42.4,17.2
OSC_IN
  Top 0.254: IC4.5 44.35,17.55 42.6,15.8 40.2,15.8 39.95,16.05 Q1.2 39.25,16.05 38.4,15.2 38.4,13.85 C19.1
OSC_OUT
  Top 0.254: IC4.6 44.85,16.2 arc-90 Q1.1 44.7,14.05 C22.1
PA0
  Top 0.254: 68.03,2.17 3.4.20 67.04,3.2 67,3.2 66.8,3.4 64,3.4 63.6,3 60.8,3 60.4,3.4 60.4,4.8 53.6,11.6 49,11.6 48.8,11.8 48.8,16.4 49.6,17.2 49.6,19 48.85,19.75 IC4.14
PA4  (via drill 0.3)
  Top 0.254: IC4.20 56.25,24.95 58.2,22.8 58.2,19 59.6,17.6 59.6,16.6 v59.2,16.2 | v62.4,16.2 63.8,14.8 63.8,14.2 64.4,13.6 66.6,13.6 67.87,14.87 3.4.10
  Bottom 0.254: v62.4,16.2 62,16.6 59.6,16.6 v59.2,16.2
PA5
  Top 0.254: IC4.21 56.55,25.45 62.2,19.8 62.2,18.4 63.4,17.2 63.4,16.2 64.73,14.87 3.4.9
PA6
  Top 0.254: IC4.22 56.85,25.95 62.8,20 62.8,18.6 64,17.4 64,16.9 64.8,16.1 66.76,16.1 3.4.8
PA7
  Top 0.254: IC4.23 57.15,26.45 63.4,20.2 63.4,19 64.99,17.41 3.4.7
PA9
  Top 0.254: IC4.42 45.35,35.75 46.2,36.6 46.8,36.6 49.2,39 61.2,39 63.4,41.2 63.4,42.2 64.61,43.41 1.2.7
PA10  (via drill 0.3)
  Top 0.254: v52.4,39.8 52.2,39.6 49,39.6 46.6,37.2 46,37.2 44.85,36.05 IC4.43 | v62.8,42.8 64.7,44.7 66.82,44.7 1.2.6
  Bottom 0.254: v52.4,39.8 52.8,39.4 61,39.4 62.8,41.2 v62.8,42.8
PA11
  Top 0.254: 1.2.5 64.75,45.95 62.6,43.8 52.6,43.8 51.4,42.6 51.4,40.8 50.8,40.2 48.8,40.2 46.4,37.8 45.8,37.8 44.35,36.35 IC4.44
PA12
  Top 0.254: 1.2.4 68.07,48.47 66.8,47.2 64.7,47.2 63.2,45.7 63.2,45.4 62.2,44.4 52.2,44.4 50.8,43 46.2,43 45.2,42 45.2,38 43.85,36.65 IC4.45
PB0
  Top 0.254: IC4.26 58.05,27.95 64.8,21.2 66.78,21.2 3.4.4
PB1
  Top 0.254: IC4.27 58.35,28.45 64,22.8 65.22,22.8 3.4.3
PB2
  Top 0.254: JP5.2 32.6,45.8 35.29,45.8 R11.1
PB5  (via drill 0.3)
  Top 0.254: IC4.57 41.55,26.95 v42,27.4 | 1.2.3 65.09,48.49 62.6,46 62.6,45.8 61.8,45 52,45 51.2,45.8 48.8,45.8 47.8,44.8 45.6,44.8 43.4,42.6 43.4,40.2 43,39.8 42.2,39.8 v42,39.6
  Bottom 0.254: v42,27.4 42,29.4 44.8,32.2 44.8,33.8 42.8,35.8 42.4,35.8 42,36.2 42,38.2 41.8,38.4 41.8,39.4 v42,39.6
PB8  (via drill 0.3)
  Top 0.254: IC4.61 42.45,24.95 v43.6,23.8 | v61.3,19 61.4,18.9 61.4,15.6 63.2,13.8 v63.2,13
  Bottom 0.254: v61.3,19 58.8,19 58.2,19.6 58.2,22 57.4,22.8 57.4,23.8 56.2,25 46,25 44.8,23.8 v43.6,23.8 | v63.2,13 63.2,12.2 64.3,11.1 66.8,11.1 68.07,9.83 3.4.14
PB9
  Top 0.254: IC4.62 38.95,24.45 38.6,24.8 37.6,24.8 36.54,23.74 R9.2
PB10  (via drill 0.3)
  Top 0.254: IC4.29 50.55,29.45 50.2,29.8 v50.2,30 | 1.2.16 66.82,32 63.2,32 v62.2,31
  Bottom 0.254: v50.2,30 60.2,30 61.2,31 v62.2,31
PB12
  Top 0.254: IC4.33 49.85,34.55 50.6,35.3 59.3,35.3 61.9,32.7 64.98,32.7 1.2.15
PB13
  Top 0.254: 1.2.14 68.07,35.77 66.8,34.5 60.9,34.5 59.4,36 50.4,36 49.35,34.95 IC4.34
PB14
  Top 0.254: IC4.35 48.85,35.25 50.2,36.6 59.6,36.6 61,35.2 64.4,35.2 64.99,35.79 1.2.13
PB15
  Top 0.254: IC4.36 48.35,35.55 50,37.2 62,37.2 64.4,39.6 66.8,39.6 1.2.10
PC0  (via drill 0.3)
  Top 0.254: IC4.8 45.85,18.75 48.2,16.4 48.2,11.6 48.8,11 53.4,11 59.4,5 v59.4,4.4
  Bottom 0.254: 3.4.16 68.05,7.25 66.8,8.5 62.5,8.5 62,8 62,5.2 61.2,4.4 v59.4,4.4
PC1  (via drill 0.3)
  Top 0.254: v47.1,18.8 46.35,19.55 IC4.9 | v57.6,13.8 58,13.8 63.8,8 63.8,6.44 3.4.17
  Bottom 0.254: v57.6,13.8 56.6,14.8 56.6,15.6 57,16 57,20.8 55.8,22 48.6,22 48,22.6 48,23.4 47.6,23.8 46.4,23.8 45.8,23.2 45.8,19.9 v47.1,18.8
PC2  (via drill 0.3)
  Top 0.254: v57.4,12.6 58.4,12.6 63.2,7.8 63.2,6.8 v63,6.6 | v46.85,22.85 IC4.10
  Bottom 0.254: v57.4,12.6 56,14 56,15.8 56.4,16.2 56.4,20.4 55.4,21.4 47.4,21.4 46.85,21.95 v46.85,22.85 | v63,6.6 63.6,6 66.78,6 3.4.18
PC3  (via drill 0.3)
  Top 0.254: v57.4,11.2 59,11.2 62.2,8 62.2,5.2 v63,4.4 | IC4.11 47.35,20.35 v47.1,20
  Bottom 0.254: v57.4,11.2 55.4,13.2 55.4,16 55.8,16.4 55.8,20.2 55.2,20.8 47.8,20.8 v47.1,20 | v63,4.4 63,2.8 63.4,2.4 65.3,2.4 3.4.19
PC4
  Top 0.254: IC4.24 57.45,26.95 64,20.4 64,19.4 64.7,18.7 66.6,18.7 67.85,19.95 3.4.6 67.95,19.95
PC5
  Top 0.254: IC4.25 57.75,27.45 65.25,19.95 3.4.5
PC6
  Top 0.254: IC4.37 47.85,35.85 49.8,37.8 61.8,37.8 64.87,40.87 1.2.9
PC7
  Top 0.254: IC4.38 47.35,36.15 49.6,38.4 61.6,38.4 64,40.8 64,41.6 64.5,42.1 66.8,42.1 68.07,43.37 1.2.8
PC10  (via drill 0.3)
  Top 0.254: IC4.51 43.45,29.95 44.6,28.8 46.6,28.8 v47,29 | v62,29.6 62.4,30 64.2,30 64.91,30.71 1.2.17
  Bottom 0.254: v47,29 47.4,29.2 50,29.2 50.2,29 51,29 51.4,29.4 61.8,29.4 v62,29.6
PC11  (via drill 0.3)
  Top 0.254: IC4.52 43.15,29.45 44.4,28.2 47.8,28.2 v48,28.4 | 1.2.18 66.76,29.4 63.2,29.4 62.4,28.6 61.2,28.6 61,28.8 60.6,28.8 v60.2,28.4
  Bottom 0.254: v48,28.4 48.4,28.4 48.6,28.6 49.8,28.6 50,28.4 51.4,28.4 51.8,28.8 59.8,28.8 v60.2,28.4
PC12  (via drill 0.3)
  Top 0.254: IC4.53 42.85,28.95 44.2,27.6 48.8,27.6 v49,27.8 | v61,27.4 61.6,28 65.36,28 1.2.19
  Bottom 0.254: v49,27.8 51.8,27.8 52.2,28.2 59,28.2 59.8,27.4 v61,27.4
PC13  (via drill 0.3)
  Top 0.254: v57.6,15.4 57.6,15.2 65.53,7.27 3.4.15 | IC4.2 42.85,20.05 v42,19.2
  Bottom 0.254: v57.6,15.4 57.6,21 56,22.6 48.8,22.6 48.6,22.8 48.6,23.6 47.8,24.4 46.2,24.4 45,23.2 44.4,23.2 43.8,22.6 43.2,22.6 42.8,22.2 42.8,20 v42,19.2
PD2  (via drill 0.3)
  Top 0.254: v50,27 44,27 42.55,28.45 IC4.54 | 1.2.20 66.7,26.8 62.6,26.8 v62.4,27
  Bottom 0.254: v50,27 52,27 52.4,27.4 58.8,27.4 59.6,26.6 60,26.6 60.2,26.4 61.4,26.4 62,27 v62.4,27
SCL_A  (via drill 0.3)
  Top 0.254: U1.6 44.03,4.76 v43.4,5.4
  Bottom 0.254: v43.4,5.4 46.54,5.4 SJ3.1
SCL_EEPROM  (via drill 0.3)
  Top 0.254: IC4.58 43.15,26.45 v43.8,25.8 | v46.2,8.6 46.95,7.85 R21.2 47.9,6.9 48.4,6.4 49.2,6.4 50,5.8 v50,4.8 TP1.TP | v60,14.2 60.8,15 60.8,18.2 60.2,18.8 v60.2,20
  Bottom 0.254: v60,14.2 59.6,13.8 59.6,10.8 56.8,8 52.8,8 52.6,7.8 51.2,7.8 50.75,8.25 47.9,8.25 47.85,8.2 46.6,8.2 v46.2,8.6 | v50,4.8 SJ3.2 | v60.2,20 60.2,21.6 58.6,23.2 58.6,24.4 56.8,26.2 44.2,26.2 v43.8,25.8
SDA_A  (via drill 0.3)
  Top 0.254: U1.5 45.26,2.34 v45.4,2.2
  Bottom 0.254: v45.4,2.2 46.94,2.2 SJ2.1
SDA_EEPROM  (via drill 0.3)
  Top 0.254: IC4.59 42.45,25.95 43.6,24.8 v44.4,24.8 | v51.8,8.6 51.05,7.85 R18.2 50.1,6.5 51,5.8 51,3.2 v50.2,2.4 TP2.TP | v59.2,15 59.4,15.2 59.8,15.2 60.2,15.6 60.2,18 59.2,19 v59.2,20.8
  Bottom 0.254: v59.2,15 59,14.8 59,11 56.6,8.6 v51.8,8.6 | v50.2,2.4 SJ2.2 | v59.2,20.8 59.2,21.8 58,23 58,24 56.4,25.6 45.2,25.6 v44.4,24.8
USART2_RTS  (via drill 0.3)
  Top 0.254: v36.8,10 36.8,6.6 v37.2,6.2 37.03,6.04 33.4,6.04 | U2.3 33.4,6.04 | TP4.TP 33.4,6.04 | U2.2 33.37,4.76 33.4,4.8 33.4,6.04 | IC4.15 49.35,20.05 50.2,19.2 50.2,12.8 v49.8,12.4
  Bottom 0.254: v49.8,12.4 49.8,11.4 49.2,10.8 39,10.8 37.8,9.6 37.2,9.6 v36.8,10 | v37.2,6.2 R2.1
USART2_RX  (via drill 0.3)
  Top 0.254: IC4.17 51.8,23.4 51.8,21.8 50.8,20.8 50.8,20.2 51.4,19.6 51.4,14 v52.2,13.2 | v37.6,7.8 37.8,8 37.8,10.6 37.4,11 29,11 28.8,11.2 28.8,11.6 28.2,12.2 27.8,12.2 26.4,13.6 24.2,13.6 24,13.8 LD1.C
  Bottom 0.254: v52.2,13.2 52.2,12 49.8,9.6 39.4,9.6 38.4,8.6 38.4,7.8 | 38.4,7.8 38.4,4.6 37.6,3.8 35.45,3.8 R4.2 | v37.6,7.8 38.4,7.8
USART2_TX  (via drill 0.3)
  Top 0.254: IC4.16 49.85,20.35 50.8,19.4 50.8,12.8 v51,12.6 | 22.2,14.4 LD2.C 22.8,14.15 22.8,13.6 23.4,13 26,13 v27.6,11.4
  Bottom 0.254: v51,12.6 51,11.6 49.6,10.2 39.2,10.2 37.6,8.6 35.25,8.6 R3.1 35.25,9.55 34.8,10 28,10 27.6,10.4 v27.6,11.4
VBAT  (via drill 0.3)
  Top 0.254: IC4.1 42.35,20.55 42.2,20.4 v41.6,20.4
  Bottom 0.254: v41.6,20.4 40.26,20.4 SJ10.2
VCC_OUT
  Top 0.254: TP8.TP 15.1,25.1 IC3.TAB
  Top 1.016: IC3.2 IC3.TAB 18.17,22.93 C16.+ 23.87,22.93 24.4,23.46 PWR_SLCT.1
VDD  (via drill 0.3)
  Top 0.254: IC4.64 38.75,23.45 v38.4,23.8 | R16.1 32.41,48.6 v31,48.6 | IC4.19 54.3,24.45 54.9,23.85 C23.1 54.25,22.6 53.6,22.6 53.4,22.4 53.4,15.4 53.8,15 v54.4,15 55.4,15 56.2,15.8 56.2,16.8 56.8,17.4 v58.6,17.4 | v51.8,32.8 51.8,31 IC4.32 | IC4.48 42.3,33 v41.4,33 | v26,2.2 26,3.33 U2.8 | v53.4,9.6 53.25,9.75 R18.1 R21.1 44.75,9.75 C13.1 | U1.8 45.2,7.37 44.6,7.37 44.6,9 C13.1 | v42.8,7.8 42.8,8.8 43.4,9.4 44.2,9.4 C13.1 | v26,11 26.3,10.7 C6.2 25.2,9.4 v24.8,9 | R20.1 R19.1 25.25,21.6 26.4,21.6 v26.8,22 | R12.1 22.55,12.45 v21.8,13.2
  Bottom 0.254: SJ10.1 38.74,20.06 38,20.8 38,21.2 37.6,21.6 37.6,21.8 C7.2 | C7.2 37,22.4 37,22.6 37.2,22.8 37.2,23.9 C24.1 38.3,23.9 v38.4,23.8 | C7.2 v26.8,22 26.4,21.6 23.4,21.6 23,21.2 23,13.2 | v31,48.6 31.2,48.4 | v54.4,15 L1.2 53.4,14.9 v53.4,9.6 | v58.6,17.4 59.4,18.2 61.8,18.2 63.4,19.8 63.4,31.6 61.8,33.2 54,33.2 53.75,33.45 C2.1 52.45,33.45 v51.8,32.8 | v42.8,7.8 42,7.8 40.8,6.6 40.8,2.4 40.4,2 26.2,2 v26,2.2 24.8,3.4 v24.8,9 | v41.4,33 41.25,33.15 C1.1 39.8,33.25 39.8,37 38.55,38.25 35.8,38.25 | v26,11 23.6,11 23,11.6 23,13.2 | v21.8,13.2 23,13.2 | JP3.1 28.8,41.4 30.4,39.8 35.2,39.8 35.8,39.2 35.8,38.25 | 35.8,38.25 R22.1 | R23.1 35.75,31.65 35.4,32 26.8,32
  Bottom 0.406: v31,48.6 29.5,48.6 C9.1 29,44.74 JP5.1 JP3.1 28.66,38.28 JTAG.1 26.8,36.35 26.8,32 v26.8,22
  Bottom 0.61: L2.2 26.9,48.1 C9.1 28.8,47.9
VSSA  (via drill 0.3)
  Top 0.254: IC4.12 47.85,18.05 v48.2,17.7
  Bottom 0.254: v48.2,17.7 48.5,17.4 L3.2

### Text on the board
tPlace: SCL | SDA | 1 | 3.3 | JTMS | GND | JTCK | GND | JTDO | 2 | GND | JTDI | GND | NRST | 3 | IRQ TEAM | v.1.001.15 | 4
tNames: 5v | VOUT | PWR_SLCT | 12v | TX | RX | A+ | B-
tValues: RST | BOOT1 | BOOT0